# Altium project ParCar.PrjPcb
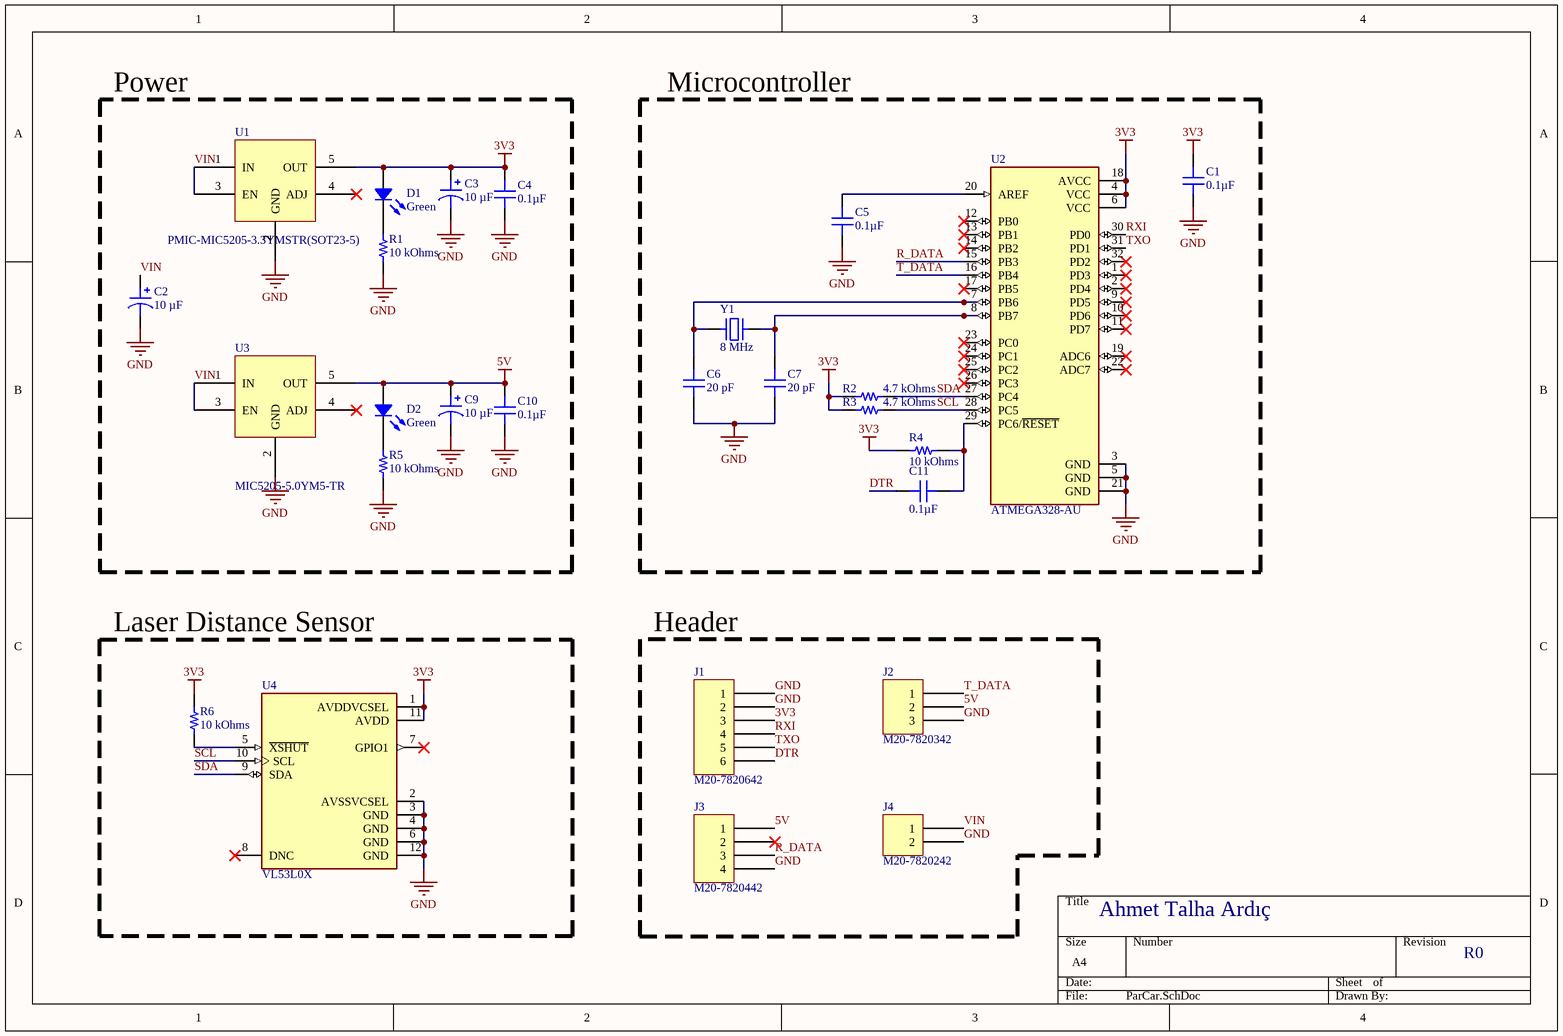
[diagram p0: ParCar.SchDoc]
1 sheet, 27 parts. Net scope: global (net labels, ports and power ports of the same name join across sheets).
Board file: ParCar.PcbDoc

## Sheet ParCar.SchDoc
size A4; SheetNumber: 1; SheetTotal: 1

### Parts
C1  0.1µF  [CAP 0603_1608]
C2  10 µF  [CAP ALSMD 4.3MM H5.4MM]
C3  10 µF  [CAP ALSMD 4.3MM H5.4MM]
C4  0.1µF  [CAP 0603_1608]
C5  0.1µF  [CAP 0603_1608]
C6  20 pF  [CAP 0603_1608]
C7  20 pF  [CAP 0603_1608]
C9  10 µF  [CAP ALSMD 4.3MM H5.4MM]
C10  0.1µF  [CAP 0603_1608]
C11  0.1µF  [CAP 0603_1608]
D1  Green  [LED 0805_2012 GREEN]
D2  Green  [LED 0805_2012 GREEN]
J1  M20-7820642  [HARWIN M20-7820645]
J2  M20-7820342  [HARWIN M20-7820345]
J3  M20-7820442  [HARWIN M20-7820445]
J4  M20-7820242  [HARWIN M20-7820245]
R1  10 kOhms  [RES 0603_1608]
R2  4.7 kOhms  [RES 0603_1608]
R3  4.7 kOhms  [RES 0603_1608]
R4  10 kOhms  [RES 0603_1608]
R5  10 kOhms  [RES 0603_1608]
R6  10 kOhms  [RES 0603_1608]
U1  PMIC-MIC5205-3.3YMSTR(SOT23-5)  [PMIC-MIC5205-3.3YMSTR(SOT23-5)]
U2  ATMEGA328-AU  [ATMEGA328-AU]
U3  MIC5205-5.0YM5-TR  [PMIC-MIC5205-3.3YMSTR(SOT23-5)]
U4  VL53L0X  [VL53L0X]
Y1  8 MHz  [ABRACON ABLS]

### Blocks framed on the sheet
Power: C2-C4 C9 C10 D1 D2 R1 R5 U1 U3
Microcontroller: C1 C5-C7 C11 R2-R4 U2 Y1
Laser Distance Sensor: R6 U4
Header: J1-J4

### Nets
3V3: C1.2 C3.1 C4.2 D1.1 J1.3 R2.2 R3.2 R4.1 R6.2 U1.5(OUT) U2.4(VCC) U2.6(VCC) U2.18(AVCC) U4.1(AVDDVCSEL) U4.11(AVDD)
5V: C9.1 C10.2 D2.1 J2.2 J3.1 U3.5(OUT)
GND: C1.1 C2.2 C3.2 C4.1 C5.1 C6.1 C7.1 C9.2 C10.1 J1.1 J1.2 J2.3 J3.4 J4.2 R1.1 R5.1 U1.2(GND) U2.3(GND) U2.5(GND) U2.21(GND) U3.2(GND) U4.2(AVSSVCSEL) U4.3(GND) U4.4(GND) U4.6(GND) U4.12(GND)
DTR: C11.1 J1.6
R_DATA: J3.3 U2.15(PB3)
RXI: J1.4 U2.30(PD0)
SCL: R3.1 U2.28(PC5) U4.10(SCL)
SDA: R2.1 U2.27(PC4) U4.9(SDA)
T_DATA: J2.1 U2.16(PB4)
TXO: J1.5 U2.31(PD1)
VIN: C2.1 J4.1 U1.1(IN) U1.3(EN) U3.1(IN) U3.3(EN)
NetC5_2: C5.2 U2.20(AREF)
NetC6_2: C6.2 U2.7(PB6) Y1.2
NetC7_2: C7.2 U2.8(PB7) Y1.1
NetC11_2: C11.2 R4.2 U2.29(PC6/~{RESET})
NetD1_2: D1.2 R1.2
NetD2_2: D2.2 R5.2
NetR6_1: R6.1 U4.5(~{XSHUT})

Not connected (* = marked no-connect by the designer): J3 2*; U1 4(ADJ)*; U2 1(PD3)* 2(PD4)* 9(PD5)* 10(PD6)* 11(PD7)* 12(PB0)* 13(PB1)* 14(PB2)* 17(PB5)* 19(ADC6)* 22(ADC7)* 23(PC0)* 24(PC1)* 25(PC2)* 26(PC3)* 32(PD2)*; U3 4(ADJ)*; U4 7(GPIO1)* 8(DNC)*

### Notes on the sheet
- Ahmet Talha Ardıç
- R0

### Library data of the parts
C1 C4 C5 C10 C11 = 06036C104JAT2A: CAP CER 0.1UF 6.3V X7R 0603; manufacturer: AVX Corporation; Tolerance: ±5%; Part Number: 06036C104JAT2A; Value: 0.1µF; Applications: General Purpose; Capacitance: 0.1µF; componentlink1description: Datasheet; componentlink1url: http://datasheets.avx.com/X7RDielectric.pdf; componentlink2description: DigiKey Link; componentlink2url: http://digikey.com/product-detail/en/avx-corporation/06036C104JAT2A/478-06036C104JAT2ACT-ND/11570344; Device Package: 0603 (1608 Metric); lastupdated: 2.09.2020 01:02:55; Lifecycle Status: Active; Minimum Order: 1; Mounting Type: Surface Mount, MLCC; Operating Temperature: -55°C ~ 125°C; Package / Case: 0603 (1608 Metric); packaging: TapeAndReel; partid: 27379; Part Status: Active; price: 0.01; series: -; Supplier 1: DigiKey; Supplier Part Number 1: 478-06036C104JAT2ACT-ND; Temperature Coefficient: X7R; Voltage - Rated: 6.3V
C2 C3 C9 = UWX1C100MCL1GB: CAP ALUM 10UF 20% 16V SMD; manufacturer: Nichicon; Lifetime @ Temp.: 2000 Hrs @ 85°C; Polarization: Polar; Ripple Current @ High Frequency: 34.5 mA @ 10 kHz; Ripple Current @ Low Frequency: 23 mA @ 120 Hz; Surface Mount Land Size: 0.169" L x 0.169" W (4.30mm x 4.30mm); Part Number: UWX1C100MCL1GB; Applications: General Purpose; Capacitance: 10 µF; componentlink1description: Datasheet; componentlink1url: https://products.nichicon.co.jp/en/pdf/XJA043/e-uwx.pdf; componentlink2description: DigiKey Link; componentlink2url: https://www.digikey.com/en/products/detail/nichicon/UWX1C100MCL1GB/589841; Device Package: Radial, Can - SMD; Height - Seated (Max): 0.213" (5.40mm); lastupdated: 14.05.2023 20:15:39; Lifecycle Status: Active; Minimum Order: 1; Mounting Type: Surface Mount; Operating Temperature: -40°C ~ 85°C; Package / Case: Radial, Can - SMD; packaging: TapeAndReel; partid: 7030; Part Status: Active; price: 0.06; series: UWX; Size / Dimension: 0.157" Dia (4.00mm); Supplier 1: DigiKey; Supplier Part Number 1: 493-2100-1-ND; Tolerance: ±20%; value: 10 µF; Voltage - Rated: 16 V
C6 C7 = C0603C200G8HAC7867: CAP CER 20PF 10V X8R 0603; manufacturer: KEMET; Tolerance: ±2%; Part Number: C0603C200G8HAC7867; Value: 20 pF; Applications: General Purpose; Capacitance: 20 pF; componentlink1description: Datasheet; componentlink1url: https://api.kemet.com/component-edge/download/datasheet/C0603C200G8HAC7867.pdf; componentlink2description: DigiKey Link; componentlink2url: https://www.digikey.com/en/products/detail/kemet/C0603C200G8HAC7867/7946222; Device Package: 0603 (1608 Metric); Features: Low ESL, High Temperature; lastupdated: 14.05.2023 19:10:00; Lifecycle Status: Active; Minimum Order: 1; Mounting Type: Surface Mount, MLCC; Operating Temperature: -55°C ~ 150°C; Package / Case: 0603 (1608 Metric); packaging: TapeAndReel; partid: 35714; Part Status: Active; price: 0.01; series: SMD Comm X8R HT150C; Size / Dimension: 0.063" L x 0.031" W (1.60mm x 0.80mm); Supplier 1: DigiKey; Supplier Part Number 1: 399-C0603C200G8HAC7867CT-ND; Temperature Coefficient: X8R; Thickness (Max): 0.034" (0.87mm); Voltage - Rated: 10V
D1 D2 = SML-LX0805GC-TR: LED GREEN CLEAR SMD; Manufacturer: Lumex Opto/Components Inc.; Configuration: Standard; Current - Test: 20mA; Lens Color: Colorless; Lens Size: 1.40mm x 1.25mm; Lens Style: Rectangle with Flat Top; Millicandela Rating: 10mcd; Viewing Angle: 140°; Voltage - Forward (Vf) (Typ): 2.2V; Wavelength - Peak: 565nm; Part Number: SML-LX0805GC-TR; Color: Green; ComponentLink1Description: Datasheet; ComponentLink1URL: https://www.lumex.com/content/files/ProductAttachment/SML-LX0805GC-TR.pdf; ComponentLink2Description: DigiKey Link; ComponentLink2URL: https://www.digikey.com/en/products/detail/lumex-opto-components-inc/SML-LX0805GC-TR/515786; Device Package: 0805 (2012 Metric); Height (Max): 1.20mm; LastUpdated: 14.05.2023 20:33:17; Lens Transparency: Clear; Lifecycle Status: Active; Minimum Order: 1; Mounting Type: Surface Mount; Package / Case: 0805 (2012 Metric); Packaging: TapeAndReel; PartId: 242; Part Status: Active; Price: 0.05; Series: -; Size / Dimension: 2.00mm L x 1.25mm W; Supplier 1: DigiKey; Supplier Part Number 1: 67-2188-1-ND; Value: Green
J1 = M20-7820642: CONN RCPT 6POS 0.1 GOLD PCB; Manufacturer: Harwin Inc.; Connector Type: Receptacle; Contact Length - Post: 0.118" (3.00mm); Current Rating (Amps): 3A; Mated Stacking Heights: 11.04mm, 12.63mm; Material Flammability Rating: UL94 V-0; Number of Positions: 6; Number of Positions Loaded: All; Pitch - Mating: 0.100" (2.54mm); Style: Board to Board or Cable; Part Number: M20-7820642; ComponentLink1Description: Datasheet; ComponentLink1URL: https://cdn.harwin.com/pdfs/C001XX_M20_Series_Connectors.pdf; ComponentLink2Description: DigiKey Link; ComponentLink2URL: https://www.digikey.com/en/products/detail/harwin-inc/M20-7820642/3727776; Contact Finish - Mating: Gold; Contact Finish - Post: Tin; Contact Finish Thickness - Mating: Flash; Contact Type: Female Socket; Fastening Type: Push-Pull; Insulation Color: Black; Insulation Height: 0.335" (8.51mm); LastUpdated: 21.09.2022 18:58:09; Lifecycle Status: Active; Minimum Order: 1; Mounting Type: Through Hole; Number of Rows: 1; Operating Temperature: -40°C ~ 105°C; Packaging: Tube; Part Status: Active; Price: 0.55; Series: M20; Supplier 1: DigiKey; Supplier Part Number 1: 952-1808-ND; Termination: Solder
J2 = M20-7820342: CONN RCPT 3POS 0.1 GOLD PCB; Manufacturer: Harwin Inc.; Connector Type: Receptacle; Contact Length - Post: 0.118" (3.00mm); Current Rating (Amps): 3A; Mated Stacking Heights: 11.04mm, 12.63mm; Material Flammability Rating: UL94 V-0; Number of Positions: 3; Number of Positions Loaded: All; Pitch - Mating: 0.100" (2.54mm); Style: Board to Board or Cable; Part Number: M20-7820342; ComponentLink1Description: Datasheet; ComponentLink1URL: https://cdn.harwin.com/pdfs/Harwin_PC_Connectors_M20.pdf; ComponentLink2Description: DigiKey Link; ComponentLink2URL: https://www.digikey.com/en/products/detail/harwin-inc/M20-7820342/3727752; Contact Finish - Mating: Gold; Contact Finish - Post: Tin; Contact Finish Thickness - Mating: Flash; Contact Type: Female Socket; Fastening Type: Push-Pull; Insulation Color: Black; Insulation Height: 0.335" (8.51mm); LastUpdated: 21.09.2022 18:55:13; Lifecycle Status: Active; Minimum Order: 1; Mounting Type: Through Hole; Number of Rows: 1; Operating Temperature: -40°C ~ 105°C; Packaging: Tube; Part Status: Active; Price: 0.42; Series: M20; Supplier 1: DigiKey; Supplier Part Number 1: 952-1783-ND; Termination: Solder
J3 = M20-7820442: CONN RCPT 4POS 0.1 GOLD PCB; Manufacturer: Harwin Inc.; Connector Type: Receptacle; Contact Length - Post: 0.118" (3.00mm); Current Rating (Amps): 3A; Mated Stacking Heights: 11.04mm, 12.63mm; Material Flammability Rating: UL94 V-0; Number of Positions: 4; Number of Positions Loaded: All; Pitch - Mating: 0.100" (2.54mm); Style: Board to Board or Cable; Part Number: M20-7820442; ComponentLink1Description: Datasheet; ComponentLink1URL: https://cdn.harwin.com/pdfs/Harwin_PC_Connectors_M20.pdf; ComponentLink2Description: DigiKey Link; ComponentLink2URL: https://www.digikey.com/en/products/detail/harwin-inc/M20-7820442/3727760; Contact Finish - Mating: Gold; Contact Finish - Post: Tin; Contact Finish Thickness - Mating: Flash; Contact Type: Female Socket; Fastening Type: Push-Pull; Insulation Color: Black; Insulation Height: 0.335" (8.51mm); LastUpdated: 21.09.2022 18:57:11; Lifecycle Status: Active; Minimum Order: 1; Mounting Type: Through Hole; Number of Rows: 1; Operating Temperature: -40°C ~ 105°C; Packaging: Tube; Part Status: Active; Price: 0.45; Series: M20; Supplier 1: DigiKey; Supplier Part Number 1: 952-1791-ND; Termination: Solder
J4 = M20-7820242: CONN RCPT 2POS 0.1 GOLD PCB; Manufacturer: Harwin Inc.; Connector Type: Receptacle; Contact Length - Post: 0.118" (3.00mm); Current Rating (Amps): 3A; Mated Stacking Heights: 11.04mm, 12.63mm; Material Flammability Rating: UL94 V-0; Number of Positions: 2; Number of Positions Loaded: All; Pitch - Mating: 0.100" (2.54mm); Style: Board to Board or Cable; Part Number: M20-7820242; ComponentLink1Description: Datasheet; ComponentLink1URL: https://cdn.harwin.com/pdfs/C001XX_M20_Series_Connectors.pdf; ComponentLink2Description: DigiKey Link; ComponentLink2URL: https://www.digikey.com/en/products/detail/harwin-inc/M20-7820242/3727744; Contact Finish - Mating: Gold; Contact Finish - Post: Tin; Contact Finish Thickness - Mating: Flash; Contact Type: Female Socket; Fastening Type: Push-Pull; Insulation Color: Black; Insulation Height: 0.335" (8.51mm); LastUpdated: 21.09.2022 18:53:47; Lifecycle Status: Active; Minimum Order: 1; Mounting Type: Through Hole; Number of Rows: 1; Operating Temperature: -40°C ~ 105°C; Packaging: Tube; Part Status: Active; Price: 0.38; Series: M20; Supplier 1: DigiKey; Supplier Part Number 1: 952-1775-ND; Termination: Solder
R1 R5 R6 = ERJ-P03J103V: RES SMD 10K OHM 5% 1/5W 0603; Manufacturer: Panasonic Electronic Components; Power (Watts): 0.2W, 1/5W; Temperature Coefficient: ±200ppm/°C; Part Number: ERJ-P03J103V; Value: 10 kOhms; ComponentLink1Description: Datasheet; ComponentLink1URL: https://industrial.panasonic.com/cdbs/www-data/pdf/RDO0000/AOA0000C331.pdf; ComponentLink2Description: DigiKey Link; ComponentLink2URL: https://www.digikey.com/en/products/detail/panasonic-electronic-components/ERJ-P03J103V/3982673; Composition: Thick Film; Device Package: 0603 (1608 Metric); Features: Automotive AEC-Q200, Pulse Withstanding; Height - Seated (Max): 0.022" (0.55mm); LastUpdated: 14.05.2023 19:35:14; Lifecycle Status: Active; Minimum Order: 1; Number of Terminations: 2; Operating Temperature: -55°C ~ 155°C; Package / Case: 0603 (1608 Metric); Packaging: TapeAndReel; PartId: 8170; Part Status: Active; Price: 0.03; Ratings: AEC-Q200; Resistance: 10 kOhms; Series: ERJ-P03; Size / Dimension: 0.063" L x 0.031" W (1.60mm x 0.80mm); Supplier 1: DigiKey; Supplier Part Number 1: P16032CT-ND; Supplier Device Package: 0603; Tolerance: ±5%
R2 R3 = ERJ-3EKF4701V: RES SMD 4.7K OHM 1% 1/10W 0603; Manufacturer: Panasonic Electronic Components; Power (Watts): 0.1W, 1/10W; Temperature Coefficient: ±100ppm/°C; Part Number: ERJ-3EKF4701V; Value: 4.7 kOhms; ComponentLink1Description: Datasheet; ComponentLink1URL: https://industrial.panasonic.com/cdbs/www-data/pdf/RDA0000/AOA0000C304.pdf; ComponentLink2Description: DigiKey Link; ComponentLink2URL: https://www.digikey.com/en/products/detail/panasonic-electronic-components/ERJ-3EKF4701V/1746419; Composition: Thick Film; Device Package: 0603 (1608 Metric); Features: Automotive AEC-Q200; Height - Seated (Max): 0.022" (0.55mm); LastUpdated: 14.05.2023 19:35:20; Lifecycle Status: Active; Minimum Order: 1; Number of Terminations: 2; Operating Temperature: -55°C ~ 155°C; Package / Case: 0603 (1608 Metric); Packaging: TapeAndReel; PartId: 5645; Part Status: Active; Price: 0.01; Ratings: AEC-Q200; Resistance: 4.7 kOhms; Series: ERJ-3EK; Size / Dimension: 0.063" L x 0.031" W (1.60mm x 0.80mm); Supplier 1: DigiKey; Supplier Part Number 1: P4.70KHCT-ND; Supplier Device Package: 0603; Tolerance: ±1%
R4 = RCS060310K0JNEA: RES SMD 10K OHM 5% 1/4W 0603; Manufacturer: Vishay Dale; Power (Watts): 0.25W, 1/4W; Temperature Coefficient: ±200ppm/°C; Part Number: RCS060310K0JNEA; Value: 10 kOhms; ComponentLink1Description: Datasheet; ComponentLink1URL: http://www.vishay.com/docs/20065/rcse3.pdf; ComponentLink2Description: DigiKey Link; ComponentLink2URL: https://www.digikey.com/en/products/detail/vishay-dale/RCS060310K0JNEA/5866963; Composition: Thick Film; Device Package: 0603 (1608 Metric); Features: Automotive AEC-Q200, Pulse Withstanding; Height - Seated (Max): 0.020" (0.50mm); LastUpdated: 14.05.2023 19:35:21; Lifecycle Status: Active; Minimum Order: 1; Number of Terminations: 2; Operating Temperature: -55°C ~ 155°C; Package / Case: 0603 (1608 Metric); Packaging: TapeAndReel; PartId: 5383; Part Status: Active; Price: 0.01; Ratings: AEC-Q200; Resistance: 10 kOhms; Series: RCS e3; Size / Dimension: 0.061" L x 0.033" W (1.55mm x 0.85mm); Supplier 1: DigiKey; Supplier Part Number 1: 541-2817-1-ND; Supplier Device Package: 0603; Tolerance: ±5%
U1 = PMIC-MIC5205-3.3YMSTR(SOT23-5): Linear Voltage Regulator IC 1 Output 150mA SOT-23-5
U2 = ATMEGA328-AU: AVR AVRÂ® ATmega Microcontroller IC 8-Bit 20MHz 32KB (16K x 16) FLASH 32-TQFP (7x7)
U3 = MIC5205-5.0YM5-TR: Linear Voltage Regulator IC Positive Fixed 1 Output 150mA SOT-23-5
U4 = VL53L0X: VL53L0X - Light, 3D Time-of-Flight _ToF_
Y1 = ABLS-8.000MHZ-SD7Y-T: CRYSTAL 8.0000MHZ 18PF SMD; Manufacturer: Abracon LLC; ESR (Equivalent Series Resistance): 80 Ohms; Frequency Stability: ±30ppm; Frequency Tolerance: ±15ppm; Operating Mode: Fundamental; Part Number: ABLS-8.000MHZ-SD7Y-T; ComponentLink1Description: Datasheet; ComponentLink1URL: https://abracon.com/Resonators/abls.pdf; ComponentLink2Description: DigiKey Link; ComponentLink2URL: https://www.digikey.com/en/products/detail/abracon-llc/ABLS-8-000MHZ-SD7Y-T/8581989; Frequency: 8 MHz; Height - Seated (Max): 0.165" (4.20mm); LastUpdated: 14.05.2023 20:37:14; Lifecycle Status: Active; Load Capacitance: 18pF; Minimum Order: 1; Mounting Type: Surface Mount; Operating Temperature: -40°C ~ 85°C; Package / Case: HC-49/US; Packaging: CutTape; PartId: 25; Part Status: Active; Price: 0.27; Series: ABLS; Size / Dimension: 0.449" L x 0.185" W (11.40mm x 4.70mm); Supplier 1: DigiKey; Supplier Part Number 1: 535-14365-2-ND; Type: MHz Crystal; Value: 8 MHz